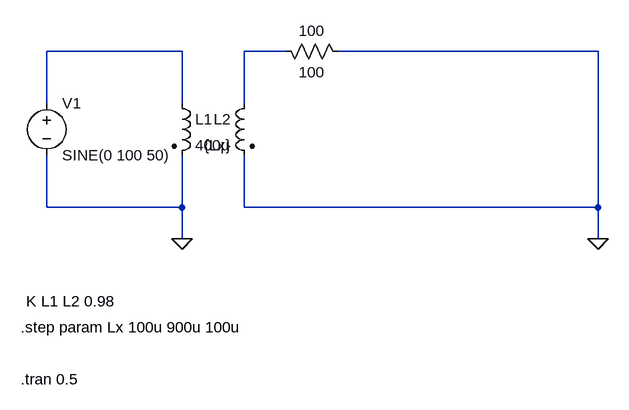
[diagram p0: schematic conjuction.asc]
conjuction.asc, the LTspice schematic file:
Version 4.1
SHEET 1 880 680
WIRE 112 -48 -96 -48
WIRE 272 -48 208 -48
WIRE 752 -48 352 -48
WIRE -96 32 -96 -48
WIRE 112 32 112 -48
WIRE 208 32 208 -48
WIRE -96 192 -96 112
WIRE 112 192 112 112
WIRE 112 192 -96 192
WIRE 208 192 208 112
WIRE 752 192 752 -48
WIRE 752 192 208 192
WIRE 112 240 112 192
WIRE 752 240 752 192
FLAG 112 240 0
FLAG 752 240 0
SYMBOL ind2 96 16 R0
SYMATTR InstName L1
SYMATTR Value 400µ
SYMATTR SpiceLine Rser=0.001
SYMBOL ind2 224 16 M0
SYMATTR InstName L2
SYMATTR Value {Lx}
SYMATTR SpiceLine Rser=0.001
SYMBOL voltage -96 16 R0
WINDOW 123 0 0 Left 0
WINDOW 39 0 0 Left 0
SYMATTR InstName V1
SYMATTR Value SINE(0 100 50)
SYMBOL res 256 -64 M90
WINDOW 0 0 56 VBottom 2
WINDOW 3 32 56 VTop 2
SYMATTR InstName 100
SYMATTR Value 100
TEXT -136 456 Left 2 !.tran 0.5
TEXT -136 376 Left 2 !.step param Lx 100u 900u 100u
TEXT -128 336 Left 2 !K L1 L2 0.98

The netlist it stands for:
* conjuction.asc
L1 N001 0 400µ Rser=0.001
L2 N002 0 {Lx} Rser=0.001
V1 N001 0 SINE(0 100 50)
R§100 N002 0 100
.tran 0.5
.step param Lx 100u 900u 100u
K L1 L2 0.98
.backanno
.end